# Altium project NodeSensor_V2.PrjPcb
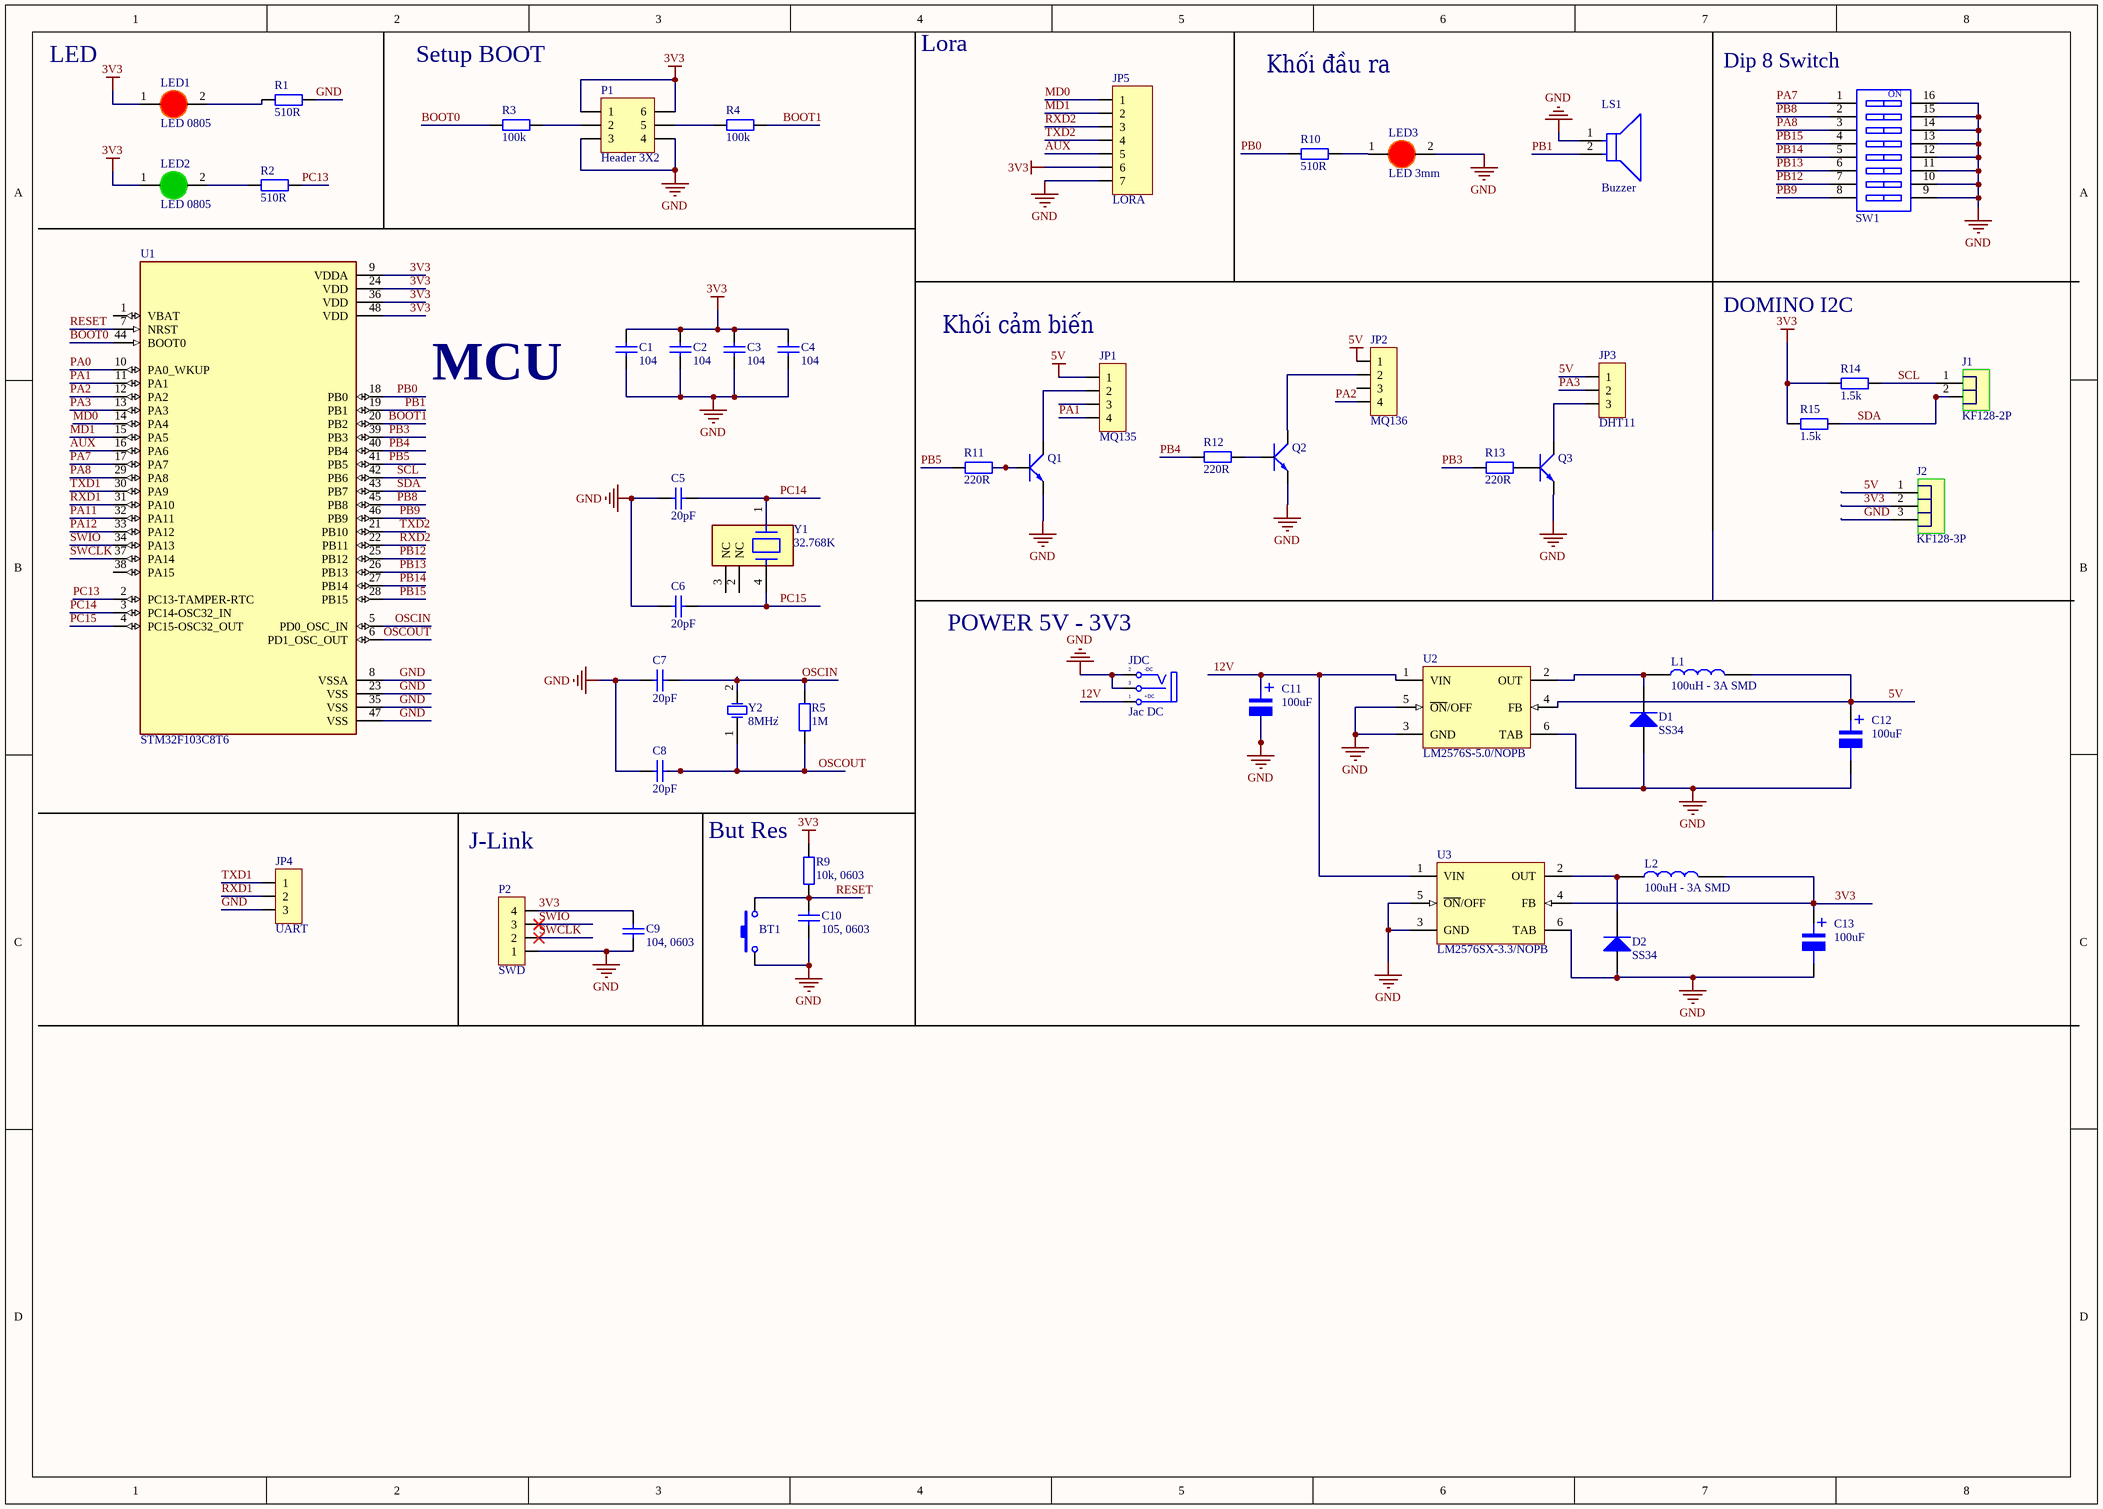
[diagram p0: Node_Schematic_V2.SchDoc]
1 sheet, 53 parts. Net scope: global (net labels, ports and power ports of the same name join across sheets).
Board file: Node_PCB_V2.PcbDoc

## Sheet Node_Schematic_V2.SchDoc
size A3; SheetNumber: 1; SheetTotal: 1

### Parts
BT1  Nut Nhan 2 Chan SMD 3x6x2.5  [Nut Nhan 2 Chan SMD 3x6x2.5]  (value not drawn)
C1  104  [tu 0603]
C2  104  [tu 0603]
C3  104  [tu 0603]
C4  104  [tu 0603]
C5  20pF  [tu 0805]
C6  20pF  [tu 0805]
C7  20pF  [tu 0805]
C8  20pF  [tu 0805]
C9  104, 0603  [tu 0603]
C10  105, 0603  [tu 0603]
C11  100uF  [tu nhom 8 (f)]
C12  100uF  [tu nhom 8 (f)]
C13  100uF  [tu nhom 8 (f)]
D1  SS34  [DIODE SMA]
D2  SS34  [DIODE SMA]
J1  KF128-2P  [KF128-5.08-2P]
J2  KF128-3P  [KF128-5.08-3P]
JDC  Jac DC  [DC-IN]
JP1  MQ135  [JP 1x4 CT]
JP2  MQ136  [JP 1x4 CT]
JP3  DHT11  [JP 1x3 CT]
JP4  UART  [JP 1x3 DT]
JP5  LORA  [JP 1x7 CT]
L1  100uH - 3A SMD  [Cuon Cam 12x12x10]
L2  100uH - 3A SMD  [Cuon Cam 12x12x10]
LED1  LED 0805  [LED-0805-Red]
LED2  LED 0805  [LED-0805-Green]
LED3  LED 3mm  [LED-3MM-RED]
LS1  Buzzer  [FP-MCKPX-G1203A-K4056-MFG]
P1  Header 3X2  [JP 2x3 DT]
P2  SWD  [JP 1x4 DT]
Q1  ?  [TO92]  (value not drawn)
Q2  ?  [TO92]  (value not drawn)
Q3  ?  [TO92]  (value not drawn)
R1  510R  [tro smd 0603]
R2  510R  [tro smd 0603]
R3  100k  [tro smd 0603]
R4  100k  [tro smd 0603]
R5  1M  [tro smd 0603]
R9  10k, 0603  [tro smd 0603]
R10  510R  [tro smd 0603]
R11  220R  [tro smd 0603]
R12  220R  [tro smd 0603]
R13  220R  [tro smd 0603]
R14  1.5k  [tro smd 0603]
R15  1.5k  [tro smd 0603]
SW1  418117270908  [418117270908]  (value not drawn)
U1  STM32F103C8T6  [QFP50P900X900X160-48N]
U2  LM2576S-5.0/NOPB  [KTT0005B_N]
U3  LM2576SX-3.3/NOPB  [KTT0005B_L]
Y1  32.768K  [FP-ABS25-MFG]
Y2  8MHz  [ABRA-ABLS-14.7456MHZ-B2-T_V]

### Nets
3V3: C1.1 C2.1 C3.1 C4.1 C9.1 C13.1 J2.2 JP5.6 L2.2 LED1.1(A) LED2.1(A) P1.1 P1.6 P2.4 R9.2 R14.1 R15.1 U1.9(VDDA) U1.24(VDD) U1.36(VDD) U1.48(VDD) U3.4(FB)
5V: C12.1 J2.1 JP1.1 JP2.1 JP3.1 L1.2 U2.4(FB)
GND: BT1.1 C1.2 C2.2 C3.2 C4.2 C5.2 C6.2 C7.2 C8.2 C9.2 C10.2 C11.2 C12.2 C13.2 D1.1(A) D2.1(A) J2.3 JDC.2(TN) JDC.3(S) JP4.3 JP5.7 LED3.2(K) LS1.1(C) P1.3 P1.4 P2.1 Q1.1(E) Q2.1(E) Q3.1(E) R1.2 SW1.9 SW1.10 SW1.11 SW1.12 SW1.13 SW1.14 SW1.15 SW1.16 U1.8(VSSA) U1.23(VSS) U1.35(VSS) U1.47(VSS) U2.3(GND) U2.5(~{ON}/OFF) U2.6(TAB) U3.3(GND) U3.5(~{ON}/OFF) U3.6(TAB)
12V: C11.1 JDC.1(T) U2.1(VIN) U3.1(VIN)
AUX: JP5.5 U1.16(PA6)
BOOT0: R3.1 U1.44(BOOT0)
BOOT1: R4.2 U1.20(PB2)
MD0: JP5.1 U1.14(PA4)
MD1: JP5.2 U1.15(PA5)
OSCIN: C7.1 R5.2 U1.5(PD0_OSC_IN) Y2.2(X2)
OSCOUT: C8.1 R5.1 U1.6(PD1_OSC_OUT) Y2.1(X1)
PA0: U1.10(PA0_WKUP)
PA1: JP1.4 U1.11(PA1)
PA2: JP2.4 U1.12(PA2)
PA3: JP3.2 U1.13(PA3)
PA7: SW1.1 U1.17(PA7)
PA8: SW1.3 U1.29(PA8)
PA11: U1.32(PA11)
PA12: U1.33(PA12)
PB0: R10.1 U1.18(PB0)
PB1: LS1.2(A) U1.19(PB1)
PB3: R13.1 U1.39(PB3)
PB4: R12.1 U1.40(PB4)
PB5: R11.1 U1.41(PB5)
PB8: SW1.2 U1.45(PB8)
PB9: SW1.8 U1.46(PB9)
PB12: SW1.7 U1.25(PB12)
PB13: SW1.6 U1.26(PB13)
PB14: SW1.5 U1.27(PB14)
PB15: SW1.4 U1.28(PB15)
PC13: R2.2 U1.2(PC13-TAMPER-RTC)
PC14: C5.1 U1.3(PC14-OSC32_IN) Y1.1
PC15: C6.1 U1.4(PC15-OSC32_OUT) Y1.4
RESET: BT1.2 C10.1 R9.1 U1.7(NRST)
RXD1: JP4.2 U1.31(PA10)
RXD2: JP5.3 U1.22(PB11)
SCL: J1.1 R14.2 U1.42(PB6)
SDA: J1.2 R15.2 U1.43(PB7)
SWCLK: P2.2 U1.37(PA14)
SWIO: P2.3 U1.34(PA13)
TXD1: JP4.1 U1.30(PA9)
TXD2: JP5.4 U1.21(PB10)
NetD1_2: D1.2(K) L1.1 U2.2(OUT)
NetD2_2: D2.2(K) L2.1 U3.2(OUT)
NetJP1_2: JP1.2 Q1.3(C)
NetJP2_2: JP2.2 Q2.3(C)
NetJP3_3: JP3.3 Q3.3(C)
NetLED1_2: LED1.2(K) R1.1
NetLED2_2: LED2.2(K) R2.1
NetLED3_1: LED3.1(A) R10.2
NetP1_2: P1.2 R3.2
NetP1_5: P1.5 R4.1
NetQ1_2: Q1.2(B) R11.2
NetQ2_2: Q2.2(B) R12.2
NetQ3_2: Q3.2(B) R13.2

Not connected (* = marked no-connect by the designer): JP1 3; JP2 3; U1 1(VBAT) 38(PA15); Y1 2(NC) 3(NC)

### Notes on the sheet
- LED
- Setup BOOT
- Lora
- Khối đầu ra
- (near SW1) Dip 8 Switch
- DOMINO I2C
- (near JP1) Khối cảm biến
- MCU
- (near JDC) POWER 5V - 3V3
- J-Link
- (near R9) But Res
- (in symbol 418117270908) ON
- (in symbol DCIN) -DC; +DC
- (in symbol Tu Nhom 100uF 50V) +

### Library data of the parts
BT1 = Nut Nhan 2 Chan SMD 3x6x2.5: Ma_Hang: MH001036; Ten: Nút Nhấn 2 Chân 3x6x2.5MM SMD
C1-C4 C9 = Tu 0603 104 50V 10%: Dán; Don_Vi: Con; So_Chan: 2; Ten_Linh_Kien: Tụ 0603 104-100nF 10% 50V; Ma_Hang: MH004568; Chung_Loai: Dán; Kieu_Chan: *
C5-C8 = Tu 0805 20pF 50V 10%: Dán; Don_Vi: Con; Ten_Linh_Kien: Tụ 0805 20P 10% 50V; So_Chan: 2; Ma_Hang: MH004558; Chung_Loai: Dán; Kieu_Chan: *
C10 = Tu 0603 105 16V 20%: Dán; Don_Vi: Con; So_Chan: 2; Ten_Linh_Kien: Tụ 0603 105-1uF 20% 16V; Ma_Hang: MH004574; Chung_Loai: Dán; Kieu_Chan: *
C11-C13 = Tu Nhom 100uF 50V: Dán; Don_Vi: Con; So_Chan: 2; Ten_Linh_Kien: Tụ Nhôm 100uF 50V 8x10.2MM; Ma_Hang: MH002223; Chung_Loai: Dán; Kieu_Chan: *
D1 D2 = Diode SS34 ( 1N5822 ): Dán; Don_Vi: Con; Ma_Hang: MH002104; Ten_Linh_Kien: Diode SS34 3A 40V SMA ( 1N5822 SS34A); Kieu_Chan: *; Chung_Loai: Dán
JDC = DCIN: Jac DC input; Value: Jac DC
JP1 JP2 = JP 1x4 2.54 Cai Thang: Cắm; Ten_Linh_Kien: Jump Đơn Cái 2.54MM 1x20P Thẳng; Don_Vi: Con; Ma_Hang: MH004006; Ghi_Chu: *; Kieu_Chan: *; Chung_Loai: Cắm
JP3 = JP 1x3 2.54 Cai Thang: Cắm; Ten_Linh_Kien: Jump Đơn Cái 2.54MM 1x20P Thẳng; Don_Vi: Con; Ma_Hang: MH004006; Ghi_Chu: *; Kieu_Chan: *; Chung_Loai: Cắm
JP4 = JP 1x3 2.54 Duc Thang: Cắm; Ten_Linh_Kien: Jump Đơn Đực 2.54MM 1x40P Thẳng 11MM; Don_Vi: Con; Ma_Hang: MH000903; Ghi_Chu: *; Kieu_Chan: *; Chung_Loai: Cắm
JP5 = JP 1x7 2.54 Cai Thang: Cắm; Ten_Linh_Kien: Jump Đơn Cái 2.54MM 1x20P Thẳng; Don_Vi: Con; Ma_Hang: MH004006; Ghi_Chu: *; Kieu_Chan: *; Chung_Loai: Cắm
L1 L2 = CUON CAM 100uH SMD: Dán; Don_Vi: Con; Ma_Hang: MH003999; Ten_Linh_Kien: Cuộn Cảm 100uH 7x7x4MM CD74; Ma_Hang: *; Kieu_Chan: *; Chung_Loai: Dán
LED1 = LED 0805 Do: Dán; Don_Vi: Con; Ma_Hang: MH000897; Ten_Linh_Kien: LED 0805 Màu Đỏ (Red); Ghi_Chu: *; Kieu_Chan: *; Chung_Loai: Dán
LED2 = LED 0805 Xanh La: Dán; Don_Vi: Con; Ma_Hang: MH002326; Ten_Linh_Kien: LED 0805 Màu Xanh Lá (Green); Ghi_Chu: *; Kieu_Chan: *; Chung_Loai: Dán
LED3 = LED 3mm Do: Cắm; Don_Vi: Con; Ma_Hang: MH003892; Ten_Linh_Kien: Led 3MM Phủ Đỏ (10c); Ghi_Chu: *; Kieu_Chan: *; Chung_Loai: Cắm
LS1 = CMP-12433-000001-1: MAGNETIC BUZZER AND TRANSDUCER - More Details; Manufacturer Part Number: MCKPX-G1203A-K4056; Manufacturer: Multicomp Pro; Operating Supply Voltage: 3V; Current: 30mA; Frequency: 2300Hz; Max Supply Voltage: 5V; Min Supply Voltage: 2V; Standoff Height: 0.5mm; ComponentLink2Description: Datasheet; ComponentLink2URL: http://www.farnell.com/datasheets/1498149.pdf?_ga=2.17855225.1157923166.1572356775-536200964.1569240579; Temperature Range High: +70°C; Device Class L2: Audio Products; Temperature Range Low: -20°C; Package: 0; Temperature: -20°C to +70°C; Category: Speak; Octopart: https://octopart.com/mckpx-g1203a-k4056-multicomp-12157154; RoHS: TRUE; Lead Free: Yes; Height: 9.5mm; Device Class L1: Electromechanical; Automotive: No; Device Class L3: Buzzers
P1 = JP 2x3 2.54 Duc Thang: Cắm; Ten_Linh_Kien: Jump Đôi Đực 2.54MM 2x40P Thẳng 11MM; Don_Vi: Con; Ma_Hang: MH002686; Ghi_Chu: *; Kieu_Chan: *; Chung_Loai: Cắm
P2 = JP 1x4 2.54 Duc Thang: Cắm; Ten_Linh_Kien: Jump Đơn Đực 2.54MM 1x40P Thẳng 11MM; Don_Vi: Con; Ma_Hang: MH000903; Ghi_Chu: *; Kieu_Chan: *; Chung_Loai: Cắm
Q1-Q3 = Trans 2N3904: NPN transistor EBC; Value: C9014
R1 R2 R10 = Tro 0603 5% 510R: Dán; Don_Vi: Con; So_Chan: 2; Ten_Linh_Kien: Trở 0603 5% 510R; Ma_Hang: MH007667; Chung_Loai: Dán; Kieu_Chan: *
R3 R4 = Tro 0603 5% 100k: Dán; So_Chan: 2; Ten_Linh_Kien: Trở 0603 5% 100k; Ma_Hang: MH006314; Don_Vi: Con; Chung_Loai: Dán; Kieu_Chan: *
R5 = Tro 0603 5% 1M: Dán; Don_Vi: Con; So_Chan: 2; Ten_Linh_Kien: Trở 0603 5% 1M; Ma_Hang: MH006909; Chung_Loai: Dán; Kieu_Chan: *
R9 = Tro 0603 1% 10k: Dán; Don_Vi: Con; So_Chan: 2; Ten_Linh_Kien: Trở 0603 1% 10k; Ma_Hang: MH006333; Chung_Loai: Dán; Kieu_Chan: *
R11-R13 = Tro 0603 5% 220R: Dán; Don_Vi: Con; So_Chan: 2; Ten_Linh_Kien: Trở 0603 5% 220R; Ma_Hang: MH006322; Chung_Loai: Dán; Kieu_Chan: *
R14 R15 = Tro 0603 5% 1.5k: Dán; Don_Vi: Con; So_Chan: 2; Ten_Linh_Kien: Trở 0603 5% 1.5k; Ma_Hang: MH006313; Chung_Loai: Dán; Kieu_Chan: *
SW1 = 418117270908: WS-DITV Compact THT Dip Switch, Raised Actuator, pitch 2.54mm, 8p; Manufacturer: Wurth Elektronik; Actuator Type: Raise Type; Operation Force: 800g; Rated Current Non-Switching: 100mA; Rated Current Switching: 25mA; Rated Voltage Non-Switching: 50VDC; Rated Voltage Switching: 24VDC; Number of Poles: 8; ComponentLink1Description: Website Link; ComponentLink1URL: https://www.we-online.com/redexpert/article/418117270908?ad; ComponentLink2Description: Datasheet Link; ComponentLink2URL: https://www.we-online.com/redexpert/spec/418117270908?ad; Manufacturer Part Number: 418117270908; Category: Dip Switches; Match Code: WS-DITV; Mount: Through Hole; Operating Temperature Max: 85°C; Operating Temperature Min: -40°C; Packaging: Tube; Contact Material: Copper Alloy; Contact Plating: Gold; Pitch: 2.54mm
U1 = STM32F103C8T6: ARM® Cortex®-M3 STM32F1 Microcontroller IC 32-Bit 72MHz 64KB (64K x 8) FLASH 48-LQFP (7x7); MF: STMicroelectronics; SnapEDA_Link: https://www.snapeda.com/parts/STM32F103C8T6/STMicroelectronics/view-part/?ref=snap; Package: LQFP-48 STMicroelectronics; Value: *; MP: STM32F103C8T6; Check_prices: https://www.snapeda.com/parts/STM32F103C8T6/STMicroelectronics/view-part/?ref=eda
U2 = CMP-0069-00114-3: SIMPLE SWITCHER® 3A Step-Down Voltage Regulator, 5-pin TO-263, Pb-Free; Manufacturer: Texas Instruments; PackageTopMarking: NSUZXYTTE#*LM2576S*-5.0 P+; PowerWise: N; RoHS: Y; Code_JEDEC: MO-169-AB; PinCount: 5; PackageReference: KTT0005B; CompType: Switcher; ComponentLink1URL: http://www.ti.com/general/docs/lit/getliterature.tsp?genericPartNumber=LM2576&fileType=pdf; ComponentLink1Description: Datasheet URL; PackageDescription: TO-263, Molded, .400 x .390 x .180in, 5 Lead, .067in Pitch, Surface Mount
U3 = CMP-0069-00110-3: SIMPLE SWITCHER® 3A Step-Down Voltage Regulator, 5-pin TO-263, Pb-Free; Manufacturer: Texas Instruments; PowerWise: N; PackageTopMarking: NSUZXYTTE#*LM2576S*-3.3 P+; PackageReference: KTT0005B; ComponentLink1Description: Datasheet URL; PinCount: 5; Code_JEDEC: MO-169-AB; CompType: Switcher; RoHS: Y; PackageDescription: TO-263, Molded, .400 x .390 x .180in, 5 Lead, .067in Pitch, Surface Mount; ComponentLink1URL: http://www.ti.com/general/docs/lit/getliterature.tsp?genericPartNumber=LM2576&fileType=pdf
Y1 = CMP-2000-05037-2: CRYSTAL 32.7680KHZ 12.5PF SMD; ESR (Equivalent Series Resistance): 50kR; Tolerance: 20ppm; Frequency: 32.768kHz; Operating Frequency: 32.768 kHz; Width: 3.8mm; REACH SVHC: No SVHC; Load Capacitance: 12.5pF; Case/Package: SMD/SMT; Radiation Hardening: No; Series: ABS25; Number of Pins: 4; Mount: Surface Mount; RoHS Compliant: Yes; Packaging: Tape and Reel; Termination: SMD/SMT; Frequency Tolerance: 20ppm; Lead Free: Lead Free; Package Quantity: 1000; Min Operating Temperature: -40°C; Height: 0.098inch; Length: 8mm; Max Operating Temperature: 85°C; Series Resistance: 50kR; Depth: 3.8mm
Y2 = CMP-2000-05726-1: Low Profile Crystal, 8.0 MHz, +/- 30 ppm, -20 to 70 degC, 2-Pin SMD, RoHS, Tape and Reel; Brand: ABRACON; Case Length: 11.4mm; Frequency Stability: 50PPM; ESR: 80Ohms; Case Height: 4.2mm; Tolerance: 30PPM; Case Width: 4.7mm; Load Capacitance: 18pF; Datasheet Version: 04/2011; Termination Style: SMD/SMT; Dimensions: 4.7mmWx11.4mmLx4.2mmH; Packaging: Reel; Manufacturer: ABRACON; Package URL: http://www.abracon.com/Support/PackageDrawing/Resonators/ABLS-2D.pdf; Mounting Technology: SurfaceMount; Package Reference: ABLS-14.7456MHZ-B2-T; Product Category: Crystals; Package Description: 2-Pin Surface Mount Device, Body 11.4 x 4.7 mm; Package / Case: HC-49/US; Mounting Style: SMD/SMT; Operating Temperature Range: -20Cto+70C; Series: ABLS; Frequency: 8MHz; Factory Pack Quantity: 1000; Datasheet URL: http://www.abracon.com/Resonators/abls.pdf; Manufacturer URL: http://www.abracon.com/; RoHS: Details; Type: LowProfileMicroprocessorCrystal